# Altium schematic sheet TM4C.SchDoc
size A3; DocumentNumber: 6-; SheetNumber: 6; SheetTotal: 7
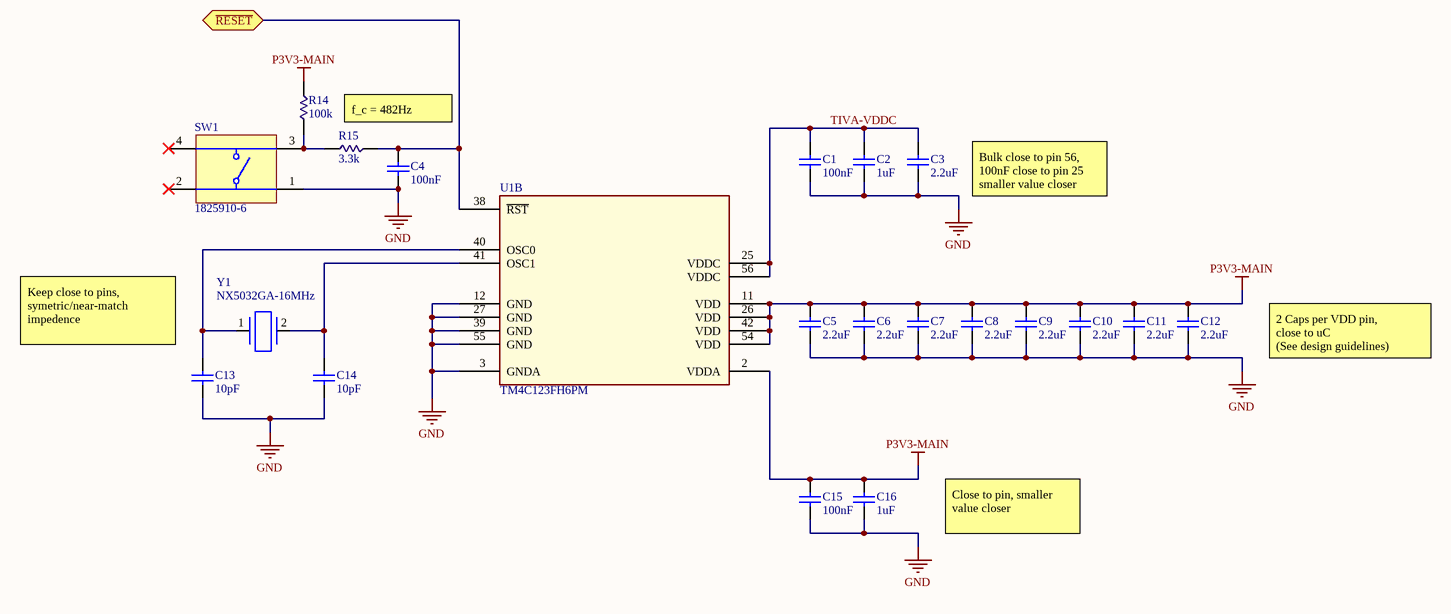
[diagram p0: TM4C.SchDoc]

## Parts
C1  value 100nF  [FOOTPRINT-0805-GEN]  (hidden comment: C0805C104K8RACTU)
C2  value 1uF  [FOOTPRINT-0805-GEN]  (hidden comment: C0805C105K8RACTU)
C3  value 2.2uF  [FOOTPRINT-0805-GEN]  (hidden comment: C0805C225K8RACTU)
C4  value 100nF  [FOOTPRINT-0805-GEN]  (hidden comment: C0805C104K8RACTU)
C5  value 2.2uF  [FOOTPRINT-0805-GEN]  (hidden comment: C0805C225K8RACTU)
C6  value 2.2uF  [FOOTPRINT-0805-GEN]  (hidden comment: C0805C225K8RACTU)
C7  value 2.2uF  [FOOTPRINT-0805-GEN]  (hidden comment: C0805C225K8RACTU)
C8  value 2.2uF  [FOOTPRINT-0805-GEN]  (hidden comment: C0805C225K8RACTU)
C9  value 2.2uF  [FOOTPRINT-0805-GEN]  (hidden comment: C0805C225K8RACTU)
C10  value 2.2uF  [FOOTPRINT-0805-GEN]  (hidden comment: C0805C225K8RACTU)
C11  value 2.2uF  [FOOTPRINT-0805-GEN]  (hidden comment: C0805C225K8RACTU)
C12  value 2.2uF  [FOOTPRINT-0805-GEN]  (hidden comment: C0805C225K8RACTU)
C13  value 10pF  [FOOTPRINT-0805-GEN]  (hidden comment: C0805C100K5RAC7800)
C14  value 10pF  [FOOTPRINT-0805-GEN]  (hidden comment: C0805C100K5RAC7800)
C15  value 100nF  [FOOTPRINT-0805-GEN]  (hidden comment: C0805C104K8RACTU)
C16  value 1uF  [FOOTPRINT-0805-GEN]  (hidden comment: C0805C105K8RACTU)
R14  value 100k  [FOOTPRINT-0805-GEN]  (hidden comment: SMC)
R15  value 3.3k  [FOOTPRINT-0805-GEN]  (hidden comment: SMC)
SW1  1825910-6  [TECO-1825910-6_V]
U1  TM4C123FH6PM  [FOOTPRINT-TI-TM4C123-64-LQFP]  (part B of 2)
Y1  NameShort: NX5032GA-16MHz  [FOOTPRINT-NDK-NX5032GA]  (hidden comment: NX5032GA-16.000000MHZ-LN-CD-1)

## Ports
~{RESET} (bidir)

## Nets
GND: C1.1 C2.1 C3.2 C4.1 C5.2 C6.2 C7.2 C8.2 C9.2 C10.2 C11.2 C12.2 C13.2 C14.2 C15.1 C16.1 SW1.1 U1.3(GNDA) U1.12(GND) U1.27(GND) U1.39(GND) U1.55(GND)
P3V3-MAIN: C5.1 C6.1 C7.1 C8.1 C9.1 C10.1 C11.1 C12.1 C15.2 C16.2 R14.2 U1.2(VDDA) U1.11(VDD) U1.26(VDD) U1.42(VDD) U1.54(VDD)
~{RESET}: C4.2 R15.2 U1.38(~{RST}) ; port ~{RESET}
TIVA-VDDC: C1.2 C2.2 C3.1 U1.25(VDDC) U1.56(VDDC)
NetC13_1: C13.1 U1.40(OSC0) Y1.1(X1)
NetC14_1: C14.1 U1.41(OSC1) Y1.2(X2)
NetR14_1: R14.1 R15.1 SW1.3

Not connected (* = marked no-connect by the designer): SW1 2* 4*

## Notes on the sheet
- f_c = 482Hz
- Bulk close to pin 56, 100nF close to pin 25
  smaller value closer
- (near C13) Keep close to pins, symetric/near-match impedence
- 2 Caps per VDD pin,
  close to uC
  (See design guidelines)
- Close to pin, smaller value closer
- Title
- Size:
- Date:
- A3
- Number:
- Time:
- Revision:
- Sheet
- of
- File:

## Library data of the parts
C1-C16 = Capacitor-Generic-0805: Capacitor; Published: 8-Jun-2000; LatestRevisionDate: 17-Jul-2002; LatestRevisionNote: Re-released for DXP Platform.; PackageReference: RAD-0.3; Publisher: Altium Limited; PackageDescription: Radial Cap, Thru-Hole; 2 Leads; 0.3 in Pin Spacing
R14 R15 = Resistor-Generic-0805-2012: 1/8 Watt Surface Mount Resistor
SW1 = CMP-1684-00021-1: Tact Switch, SPST-NO, 0.05 A, -35 to 85 degC, 4-Pin THD, RoHS, Bulk; Manufacturer: TE Connectivity; Maximum Contact Resistance: 100mOhm; Mechanical Life: 100000Cycles; Bushing Type: Unthreaded; Switch Configuration: OFF(ON); Maximum DC Voltage Rating: 24V; Contact Rating @ Voltage: 0.05A@24VDC; Actuator Color: Black; Body Orientation: Straight; Function: MomentaryContact; Illumination: N/R; Actuator Style: RoundButton; Actuator Material: PolybutyleneTerephthalate; Dielectric Strength: 500VAC; Pole Throw Configuration: SPST; Actuator Length: 1.4mm; Product Weight: N/A; Contact Material: CopperAlloy; Housing Material: N/A; Terminal Type: PCPins; Minimum Insulation Resistance: 100MOhm; Package Description: 4-Pin Through Hole Device, Body 5.99 x 5.99 mm, Pitch 6.5 mm; Part No: 1825910-6; Package Reference: THD; Base Material: N/A; Manufacturer URL: http://www.te.com; Contact Plating: Silver; RoHS: Yes; Datasheet Version: Rev. C9; Electrical Life: 100000Cycles; Maximum AC Voltage Rating: N/A; Thread Size: N/R; Operating Temperature: -35to85C; Mounting: ThroughHole; Dimension: 5.99x5mm; Datasheet URL: http://www.te.com/commerce/DocumentDelivery/DDEController?Action=showdoc&DocId=Customer+Drawing%7F1825910%7FC9%7Fpdf%7FEnglish%7FENG_CD_1825910_C9.pdf%7F1825910-6; Family: 1825910; Seal Location: N/A; Seal Description: N/A; Packaging: N/A
U1 = IC-TI-TM4C123FH6PM
Y1 = Crystal-NDK-NX5032GA-16MHz